# Altium schematic sheet [06] SM 1232 AQ2.SchDoc
size 152 x 114 mm
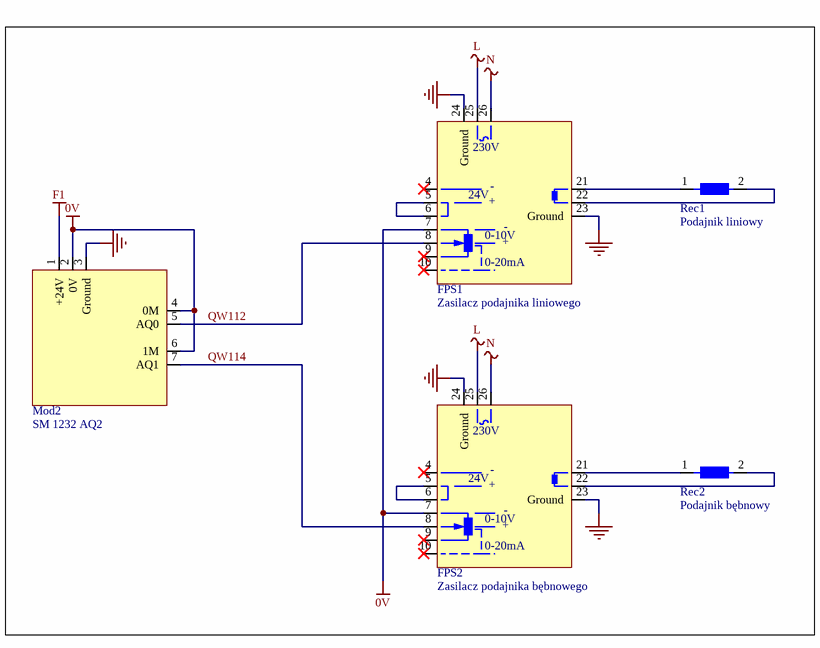
[diagram p0: [06] SM 1232 AQ2.SchDoc]

## Parts
FPS1  Zasilacz podajnika liniowego
FPS2  Zasilacz podajnika bębnowego
Mod2  SM 1232 AQ2
Rec1  Podajnik liniowy
Rec2  Podajnik bębnowy

## Nets
0V: FPS1.7(potentiometer_0V) FPS2.7(potentiometer_0V) Mod2.2(0V) Mod2.4(0M) Mod2.6(1M)
F1: Mod2.1(+24V)
GND: FPS1.23(Ground) FPS1.24(Ground) FPS2.23(Ground) FPS2.24(Ground) Mod2.3(Ground)
L: FPS1.25(Line) FPS2.25(Line)
N: FPS1.26(Line) FPS2.26(Line)
QW112: FPS1.8(potentiometer_q) Mod2.5(AQ0)
QW114: FPS2.8(potentiometer_q) Mod2.7(AQ1)
NetFPS1_5: FPS1.5(24V) FPS1.6(??)
NetFPS1_21: FPS1.21(Feed) Rec1.1
NetFPS1_22: FPS1.22(Feed) Rec1.2
NetFPS2_5: FPS2.5(24V) FPS2.6(??)
NetFPS2_21: FPS2.21(Feed) Rec2.1
NetFPS2_22: FPS2.22(Feed) Rec2.2

Not connected (* = marked no-connect by the designer): FPS1 4(0V)* 9(Potentiiometer_+10V)* 10(??)*; FPS2 4(0V)* 9(Potentiiometer_+10V)* 10(??)*

## Notes on the sheet
- (in symbol Feed power supply) 230V; -; +; 0-10V; 0-20mA

## Library data of the parts
FPS1 FPS2 = Feed power supply
Rec1 Rec2 = Receiver